# Altium project touchpad1.PrjPcb
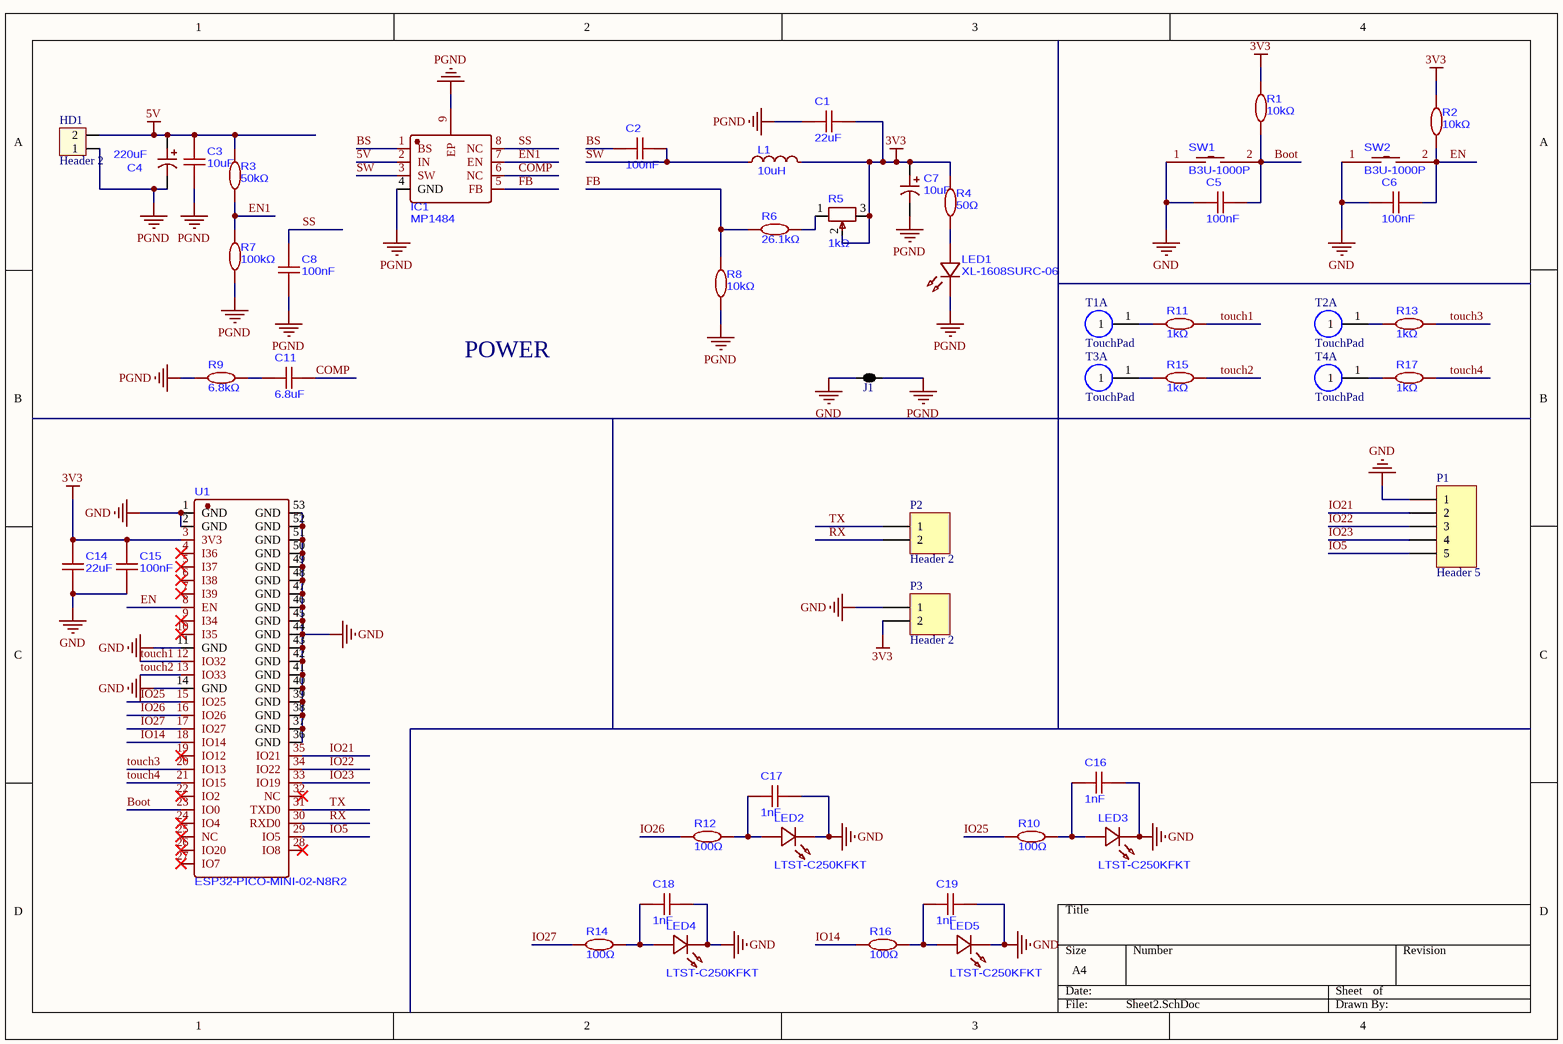
[diagram p0: Sheet2.SchDoc]
1 sheet, 51 parts. Net scope: global (net labels, ports and power ports of the same name join across sheets).
Board file: PCB2.PcbDoc

## Sheet Sheet2.SchDoc
size A4; SheetNumber: 1; SheetTotal: 1; SPICEModelCacheBTJANAEP: <root> / <DocumentId>BTJANAEP</DocumentId> / </root>

### Parts
C1  22uF  [C0603]
C2  100nF  [C0603]
C3  10uF  [C0603]
C4  220uF  [CAP-SMD_BD6.3-L6.6-W6.6-FD]
C5  100nF  [C0603]
C6  100nF  [C0603]
C7  10uF  [CAP-SMD_BD6.3-L6.6-W6.6-FD]
C8  100nF  [C0603]
C11  6.8uF  [C0603]
C14  22uF  [C0603]
C15  100nF  [C0603]
C16  1nF  [C0603]
C17  1nF  [C0603]
C18  1nF  [C0603]
C19  1nF  [C0603]
HD1  Header 2  [HED2]
IC1  MP1484  [SOP-8_L4.9-W3.9-P1.27-LS6.0-BL-EP3.1]
J1  2 way net tie junction  [2way_HP]  (value not drawn)  (net tie, no BOM)
L1  10uH  [IND-SMD_L6.0-W6.0_VLS6045EX-2R0N]
LED1  XL-1608SURC-06  [LED0603-RD_RED]
LED2  LTST-C250KFKT  [LED1206_LTST-C230KRKT]
LED3  LTST-C250KFKT  [LED1206_LTST-C230KRKT]
LED4  LTST-C250KFKT  [LED1206_LTST-C230KRKT]
LED5  LTST-C250KFKT  [LED1206_LTST-C230KRKT]
P1  Header 5  [HDR1X5]
P2  Header 2  [HDR1X2]
P3  Header 2  [HDR1X2]
R1  10kΩ  [R0603]
R2  10kΩ  [R0603]
R3  50kΩ  [R0603]
R4  50Ω  [R0603]
R5  1kΩ  [RES-ADJ-SMD_3P-L4.5-W4.5-P2.30-BL-FS]
R6  26.1kΩ  [R0603]
R7  100kΩ  [R0603]
R8  10kΩ  [R0603]
R9  6.8kΩ  [R0603]
R10  100Ω  [R0603]
R11  1kΩ  [R0603]
R12  100Ω  [R0603]
R13  1kΩ  [R0603]
R14  100Ω  [R0603]
R15  1kΩ  [R0603]
R16  100Ω  [R0603]
R17  1kΩ  [R0603]
SW1  B3U-1000P  [KEY-SMD_B3U-1000PM]
SW2  B3U-1000P  [KEY-SMD_B3U-1000PM]
T1  TouchPad  [TouchPad]  (part A of 2)
T2  TouchPad  [TouchPad]  (part A of 2)
T3  TouchPad  [TouchPad]  (part A of 2)
T4  TouchPad  [TouchPad]  (part A of 2)
U1  ESP32-PICO-MINI-02-N8R2  [BULETM-SMD_ESP32-PICO-MINI-02-N8R2]

### Nets
3V3: C1.2 C7.1 C14.2 C15.1 L1.2 P3.2 R1.2 R2.2 R4.2 R5.2 R5.3 U1.3(3V3)
5V: C3.2 C4.1 HD1.2 IC1.2(IN) R3.2
GND: C5.2 C6.2 C14.1 C15.2 C16.2 C17.2 C18.2 C19.2 J1.1 LED2.2(C) LED3.2(C) LED4.2(C) LED5.2(C) P1.1 P3.1 SW1.1 SW2.1 U1.1(GND) U1.2(GND) U1.11(GND) U1.14(GND) U1.36(GND) U1.37(GND) U1.38(GND) U1.39(GND) U1.40(GND) U1.41(GND) U1.42(GND) U1.43(GND) U1.44(GND) U1.45(GND) U1.46(GND) U1.47(GND) U1.48(GND) U1.49(GND) U1.50(GND) U1.51(GND) U1.52(GND) U1.53(GND)
PGND: C1.1 C3.1 C4.2 C7.2 C8.1 HD1.1 IC1.4(GND) IC1.9(EP) J1.2 LED1.1(K) R7.1 R8.1 R9.1
Boot: C5.1 R1.1 SW1.2 U1.23(IO0)
BS: C2.2 IC1.1(BS)
COMP: C11.2 IC1.6(NC)
EN: C6.1 R2.1 SW2.2 U1.8(EN)
EN1: IC1.7(EN) R3.1 R7.2
FB: IC1.5(FB) R6.1 R8.2
IO5: P1.5 U1.29(IO5)
IO14: R16.1 U1.18(IO14)
IO21: P1.2 U1.35(IO21)
IO22: P1.3 U1.34(IO22)
IO23: P1.4 U1.33(IO19)
IO25: R10.1 U1.15(IO25)
IO26: R12.1 U1.16(IO26)
IO27: R14.1 U1.17(IO27)
RX: P2.2 U1.30(RXD0)
SS: C8.2 IC1.8(NC)
SW: C2.1 IC1.3(SW) L1.1
touch1: R11.2 U1.12(IO32)
touch2: R15.2 U1.13(IO33)
touch3: R13.2 U1.20(IO13)
touch4: R17.2 U1.21(IO15)
TX: P2.1 U1.31(TXD0)
NetC11_1: C11.1 R9.2
NetC16_1: C16.1 LED3.1(A) R10.2
NetC17_1: C17.1 LED2.1(A) R12.2
NetC18_1: C18.1 LED4.1(A) R14.2
NetC19_1: C19.1 LED5.1(A) R16.2
NetLED1_2: LED1.2(A) R4.1
NetR5_1: R5.1 R6.2
NetR11_1: R11.1 T1.1
NetR13_1: R13.1 T2.1
NetR15_1: R15.1 T3.1
NetR17_1: R17.1 T4.1

Not connected (* = marked no-connect by the designer): U1 4(I36)* 5(I37)* 6(I38)* 7(I39)* 9(I34)* 10(I35)* 19(IO12)* 22(IO2)* 24(IO4)* 25(NC)* 26(IO20)* 27(IO7)* 28(IO8)* 32(NC)*

### Notes on the sheet
- POWER

### Library data of the parts
C1 C14 = CL10A226MP8NUNE: 10V 22uF X5R ±20% 0603 Ceramic Capacitors ROHS
C2 C5 C6 C8 C15 = CC0603KRX7R9BB104: 50V 100nF X7R ±10% 0603 Ceramic Capacitors ROHS
C3 = CL10A106KP8NNNC: 10V 10uF X5R ±10% 0603 Ceramic Capacitors ROHS
C4 = RVT220UF10V67RV0037: 220uF 10V ±20% 69mA@120Hz SMD,D6.3xL5.4mm Aluminum Electrolytic Capacitors ROHS
C7 = RST10UF50V016: 10uF 50V 24mA@120Hz ±20% SMD,D5xL5.4mm Aluminum Electrolytic Capacitors ROHS
C11 = C1608X5R1A685KT000E: 10V 6.8uF X5R ±10% 0603 Ceramic Capacitors ROHS
C16-C19 = CL10B102KB8NNNC: 50V 1nF X7R ±10% 0603 Ceramic Capacitors ROHS
HD1 = Hed2: Header 2 (Green); Value: Header 2
IC1 = MP1484: The MP1484 is a monolithic synchronous buck / regulator.
J1 = 2way: ComponentLink1URL: http://www.edatools.cz/addons; ComponentLink1Description: Source; FootprintNote: LP=12mil, MP=40mil, HP=120mil
L1 = VLS6045EX-100M: 3.4A 10uH ±20% 3.9A 47mΩ SMD,6x6mm Fixed Inductors ROHS
LED2-LED5 = LTST-C250KFKT: 20mA Orange 1.6V~2.4V 62.5mW 1205 LED Indication - Discrete ROHS
P1 = Header 5: Header, 5-Pin; System: Connector; LatestRevisionDate: 17-Jul-2002; LatestRevisionNote: Re-released for DXP Platform.; Publisher: Altium Limited
P2 P3 = Header 2: Header, 2-Pin; LatestRevisionDate: 17-Jul-2002; LatestRevisionNote: Re-released for DXP Platform.; Publisher: Altium Limited
R1 R2 R8 = RC0603FR-0710KL: 100mW 10kΩ 75V ±100ppm/℃ Thick Film Resistor ±1% 0603 Chip Resistor - Surface Mount ROHS
R3 = RT0603BRD0750KL: 50kΩ 100mW 75V ±25ppm/℃ Thin Film Resistor ±0.1% 0603 Chip Resistor - Surface Mount ROHS
R4 = RT0603BRE0750RL: 100mW 50Ω 75V ±50ppm/℃ Thin Film Resistor ±0.1% 0603 Chip Resistor - Surface Mount ROHS
R5 = 3314J-1-102E: ±20% ±100ppm/℃ 250mW 1kΩ SMD,4.5x4.5mm Trimmer Potentiometers ROHS
R6 = 0603WAF2612T5E: 100mW 26.1kΩ 75V ±100ppm/℃ Thick Film Resistor ±1% 0603 Chip Resistor - Surface Mount ROHS
R7 = RC0603FR-07100KL: 100mW 100kΩ 75V ±100ppm/℃ Thick Film Resistor ±1% 0603 Chip Resistor - Surface Mount ROHS
R9 = FRC0603F6801TS: 6.8kΩ 100mW 75V ±100ppm/℃ Thick Film Resistor ±1% 0603 Chip Resistor - Surface Mount ROHS
R10 R12 R14 R16 = RC0603FR-07100RL: 100mW 100Ω 75V ±100ppm/℃ Thick Film Resistor ±1% 0603 Chip Resistor - Surface Mount ROHS
R11 R13 R15 R17 = RMC 0603 1K J N: 100mW 1kΩ 50V ±100ppm/℃ Thick Film Resistor ±5% 0603 Chip Resistor - Surface Mount ROHS
SW1 SW2 = B3U-1000P: 12V 2.5mm Round Button 3mm SPST 50mA SMD,3x2.5mm Tactile Switches ROHS
T1-T4 = TouchPad: pad cam ung dien dung
U1 = ESP32-PICO-MINI-02-N8R2: ESP32-PICO-MINI-02 and ESP32-PICO-MINI-02U are two general-purpose Wi-Fi + Bluetooth + Bluetooth LEMCU modules